# EAGLE design main (EAGLE 5.11)
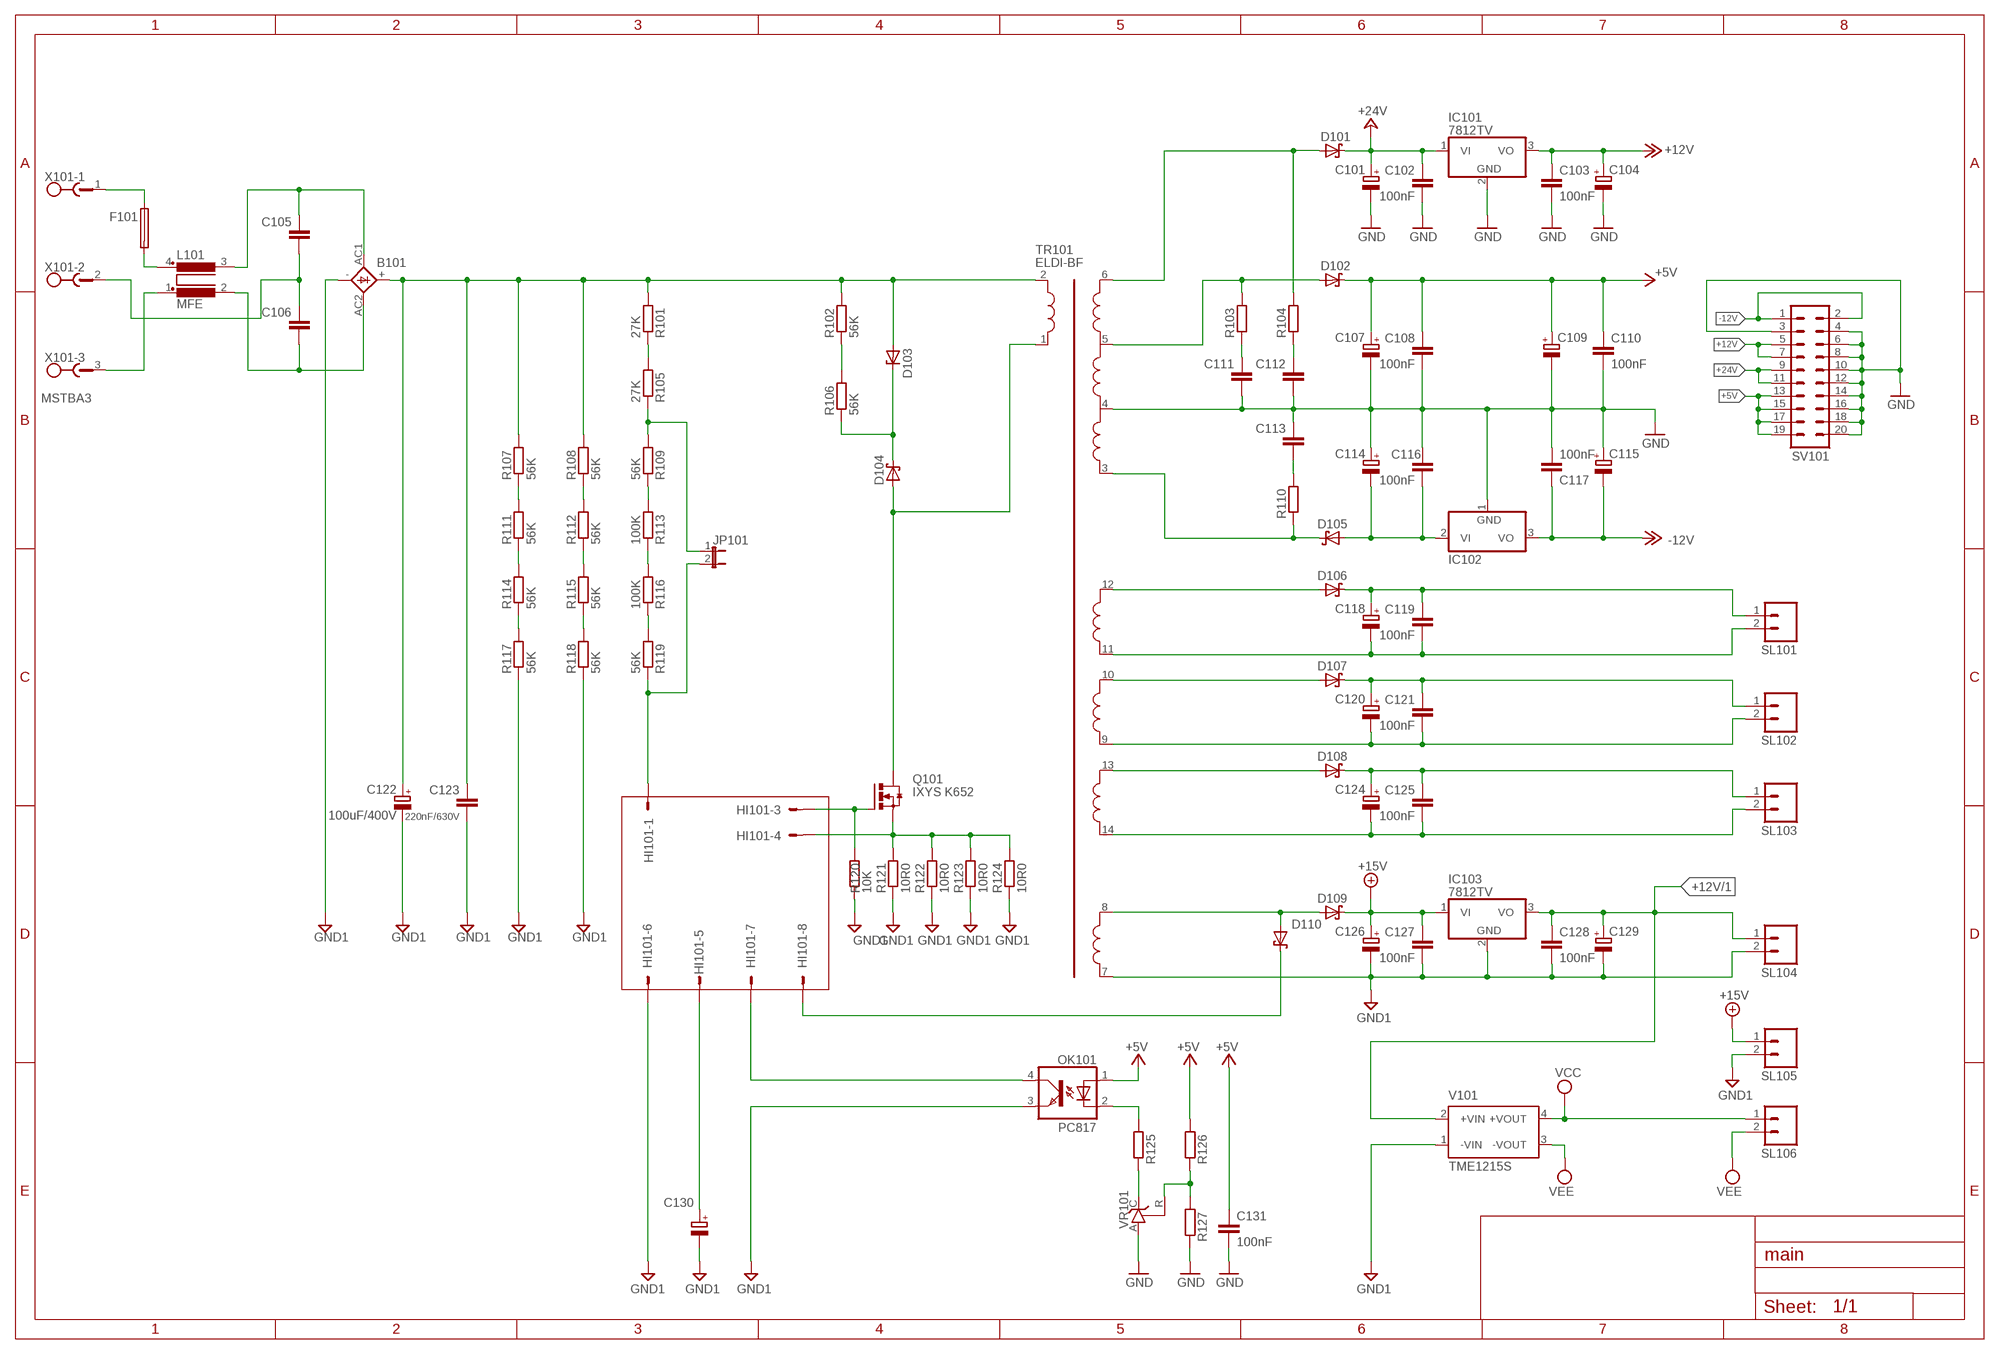
[diagram p0: schematic, sheet 1]

## Parts
B101  KBU  [KBU]
C101  CPOL-EUE3.5-10  [E3,5-10]
C102  100nF  C-EUC1206  [C1206]
C103  100nF  C-EUC1206  [C1206]
C104  CPOL-EUE3.5-10  [E3,5-10]
C105  C-EU102-054X133  [C102-054X133]
C106  C-EU102-054X133  [C102-054X133]
C107  CPOL-EUE3.5-10  [E3,5-10]
C108  100nF  C-EUC1206  [C1206]
C109  CPOL-EUE3.5-10  [E3,5-10]
C110  100nF  C-EUC1206  [C1206]
C111  C-EUC1206  [C1206]
C112  C-EUC1206  [C1206]
C113  C-EUC1206  [C1206]
C114  CPOL-EUE3.5-10  [E3,5-10]
C115  CPOL-EUE3.5-10  [E3,5-10]
C116  100nF  C-EUC1206  [C1206]
C117  100nF  C-EUC1206  [C1206]
C118  CPOL-EUE3.5-8  [E3,5-8]
C119  100nF  C-EUC1206  [C1206]
C120  CPOL-EUE3.5-8  [E3,5-8]
C121  100nF  C-EUC1206  [C1206]
C122  100uF/400V  CPOL-EUE10-25  [EB25D]
C123  220nF/630V  C-EU225-062X268  [C225-062X268]
C124  CPOL-EUE3.5-8  [E3,5-8]
C125  100nF  C-EUC1206  [C1206]
C126  CPOL-EUE3.5-8  [E3,5-8]
C127  100nF  C-EUC1206  [C1206]
C128  100nF  C-EUC1206  [C1206]
C129  CPOL-EUE3.5-8  [E3,5-8]
C130  CPOL-EUE3.5-8  [E3,5-8]
C131  100nF  C-EUC1206  [C1206]
D101  SCHOTTKY-DIODESMD  [SMB]
D102  SCHOTTKY-DIODESMD  [SMB]
D103  ZENER-DIODESMB  [SMB]
D104  SCHOTTKY-DIODESMD  [SMB]
D105  SCHOTTKY-DIODESMD  [SMB]
D106  SCHOTTKY-DIODESMD  [SMB]
D107  SCHOTTKY-DIODESMD  [SMB]
D108  SCHOTTKY-DIODESMD  [SMB]
D109  SCHOTTKY-DIODESMD  [SMB]
D110  SCHOTTKY-DIODESMD  [SMB]
F101  GSH15  [GSH15]
HI101  M08S  [08P]
IC101  7812TV  [TO220V]
IC102  7912T  [TO220H]
IC103  7812TV  7805TV  [TO220V]
JP101  JP1E  [JP1]
L101  MFE  [MFE]
OK101  PC817  [DIL04]
Q101  IXYS K652  IRF3704S  [D2PACK]
R101  27K  R-EU_R1206  [R1206]
R102  56K  R-EU_R1206  [R1206]
R103  R-EU_R1206  [R1206]
R104  R-EU_R1206  [R1206]
R105  27K  R-EU_R1206  [R1206]
R106  56K  R-EU_R1206  [R1206]
R107  56K  R-EU_R1206  [R1206]
R108  56K  R-EU_R1206  [R1206]
R109  56K  R-EU_R1206  [R1206]
R110  R-EU_R1206  [R1206]
R111  56K  R-EU_R1206  [R1206]
R112  56K  R-EU_R1206  [R1206]
R113  100K  R-EU_R1206  [R1206]
R114  56K  R-EU_R1206  [R1206]
R115  56K  R-EU_R1206  [R1206]
R116  100K  R-EU_R1206  [R1206]
R117  56K  R-EU_R1206  [R1206]
R118  56K  R-EU_R1206  [R1206]
R119  56K  R-EU_R1206  [R1206]
R120  10K  R-EU_R1206  [R1206]
R121  10R0  R-EU_R1206  [R1206]
R122  10R0  R-EU_R1206  [R1206]
R123  10R0  R-EU_R1206  [R1206]
R124  10R0  R-EU_R1206  [R1206]
R125  R-EU_R1206  [R1206]
R126  R-EU_R1206  [R1206]
R127  R-EU_R1206  [R1206]
SL101  M02  [02P]
SL102  M02  [02P]
SL103  M02  [02P]
SL104  M02  [02P]
SL105  M02  [02P]
SL106  M02  [02P]
SV101  ML20  [ML20]
TR101  ELDI-BF  TRAF-ELDY-BF  [TRAF-ELDI-BF]
V101  TME1215S  [TME]
VR101  TL431CLP  [TO92-CLP]
X101  MSTBA3  [MSTBA3]

## Nets
+5V: C107.+ C108.1 C109.+ C110.1 C131.1 D102.C OK101.1(A) R126.2 SV101.13 SV101.15 SV101.17 SV101.19
+12V: C103.1 C104.+ IC101.3(VO) SV101.5 SV101.7
+12V/1: C128.1 C129.+ IC103.3(VO) SL104.1 V101.2(+VIN)
+15V: C126.+ C127.1 D109.C IC103.1(VI) SL105.1
+24V: C101.+ C102.1 D101.C IC101.1(VI) SV101.9 SV101.11
-12V: C115.- C117.1 IC102.3(VO) SV101.1 SV101.2
GND: C101.- C102.2 C103.2 C104.- C107.- C108.2 C109.- C110.2 C111.2 C112.2 C113.1 C114.+ C115.+ C116.2 C117.2 C131.2 IC101.2(GND) IC102.1(GND) R127.1 SV101.3 SV101.4 SV101.6 SV101.8 SV101.10 SV101.12 SV101.14 SV101.16 SV101.18 SV101.20 TR101.4 VR101.A
GND1: B101.- C122.- C123.2 C126.- C127.2 C128.2 C129.- C130.- HI101.6 IC103.2(GND) OK101.3(EMIT) R117.1 R118.1 R120.1 R121.1 R122.1 R123.1 R124.1 SL104.2 SL105.2 TR101.7 V101.1(-VIN)
N$1: F101.1 X101.1
N$2: F101.2 L101.4
N$3: L101.1 X101.3
N$4: B101.+ C122.+ C123.1 D103.A R101.2 R102.2 R107.2 R108.2 TR101.2
N$9: C114.- C116.1 D105.A IC102.2(VI)
N$10: D105.C R110.1 TR101.3
N$11: D101.A R104.2 TR101.6
N$12: R114.1 R117.2
N$13: D102.A R103.2 TR101.5
N$14: B101.AC2 C106.2 L101.2
N$15: B101.AC1 C105.1 L101.3
N$16: C113.2 R110.2
N$17: C111.1 R103.1
N$18: C112.1 R104.1
N$19: HI101.4 Q101.3(S) R121.2 R122.2 R123.2 R124.2
N$20: HI101.3 Q101.1(G) R120.2
N$21: D104.A Q101.2(D) TR101.1
N$22: D103.C D104.C R106.1
N$23: C105.2 C106.1 X101.2
N$24: R102.1 R106.2
N$25: D109.A D110.A TR101.8
N$26: D108.A TR101.13
N$27: D106.A TR101.12
N$28: R111.1 R114.2
N$30: D110.C HI101.8
N$32: D107.A TR101.10
N$33: R125.1 VR101.C
N$34: OK101.2(C) R125.2
N$35: R126.1 R127.2 VR101.R
N$36: JP101.1 R105.1 R109.2
N$37: HI101.7 OK101.4(COL)
N$38: R107.1 R111.2
N$39: R113.1 R116.2
N$40: R116.1 R119.2
N$41: R109.1 R113.2
N$42: HI101.1 JP101.2 R119.1
N$43: R101.1 R105.2
N$61: R108.1 R112.2
N$62: R112.1 R115.2
N$63: R115.1 R118.2
N$64: C130.+ HI101.5
U+: C118.+ C119.1 D106.C SL101.1
U_GND: C118.- C119.2 SL101.2 TR101.11
V+: C120.+ C121.1 D107.C SL102.1
V_GND: C120.- C121.2 SL102.2 TR101.9
VCC: SL106.1 V101.4(+VOUT)
VEE: SL106.2 V101.3(-VOUT)
W+: C124.+ C125.1 D108.C SL103.1
W_GND: C124.- C125.2 SL103.2 TR101.14
Unconnected: HI101.2

## Library data of the parts
B101 = rectifier:KBU: DIOTEC RECTIFIER
C101 C104 C107 C109 C114 C115 C118 C120 C122 C124 C126 C129 C130 = rcl:CPOL-EU: POLARIZED CAPACITOR, European symbol
C102 C103 C105 C106 C108 C110-C113 C116 C117 C119 C121 C123 C125 C127 C128 C131 = rcl:C-EU: CAPACITOR, European symbol
D101 D102 D104-D110 = diode:SCHOTTKY-DIODE: Schottky Diode
D103 = diode:ZENER-DIODE: Z-Diode
F101 = fuse:GSH15: FUSE HOLDER grid 15mm, 19649 Wickmann; MPN: 64900001039; OC_FARNELL: 1271673; OC_NEWARK: 02P0318
HI101 = con-amp-quick:M08S: AMP QUICK CONNECTOR; OC_FARNELL: unknown; OC_NEWARK: unknown
IC101 IC103 = linear:78*: Positive VOLTAGE REGULATOR Source: http://cache.national.com/ds/LM/LM78L05.pdf http://www.fairchildsemi.com/ds/LM/LM7805.pdf
IC102 = linear:79*: Negative VOLTAGE REGULATOR
JP101 = jumper:JP1E: JUMPER
L101 = inductors:MFE: FILTER
OK101 = optocoupler:PC817: SHARP OPTO COUPLER; MPN: PC817X4J000F; OC_FARNELL: 9707727; OC_NEWARK: 97K7059
Q101 = transistor-power:IRF3704: SMPS MOSFET HEXFET® Power MOSFET Source: http://www.irf.com/product-info/datasheets/data/irf3704.pdf
R101-R127 = rcl:R-EU_: RESISTOR, European symbol
SL101-SL106 = con-amp-quick:M02: AMP QUICK CONNECTOR; OC_FARNELL: unknown; OC_NEWARK: unknown
SV101 = con-harting-ml:ML20: HARTING; OC_FARNELL: unknown; OC_NEWARK: unknown
TR101 = electroinvent:TRAF-ELDY-BF
V101 = traco-electronic:TME?*: DC/DC Converter TME Series 1 Watt Source: www.tracopower.com .. tme.pdf; MPN: TME 1215S; OC_FARNELL: 1007546; OC_NEWARK: 51R5328
VR101 = v-reg:TL431CLP: VOLTAGE REGULATOR
X101 = con-phoenix-508:MSTBA3: PHOENIX; MF: FARNELL; MPN: 1757255; OC_FARNELL: 3705183; OC_NEWARK: 71C4162

## Board
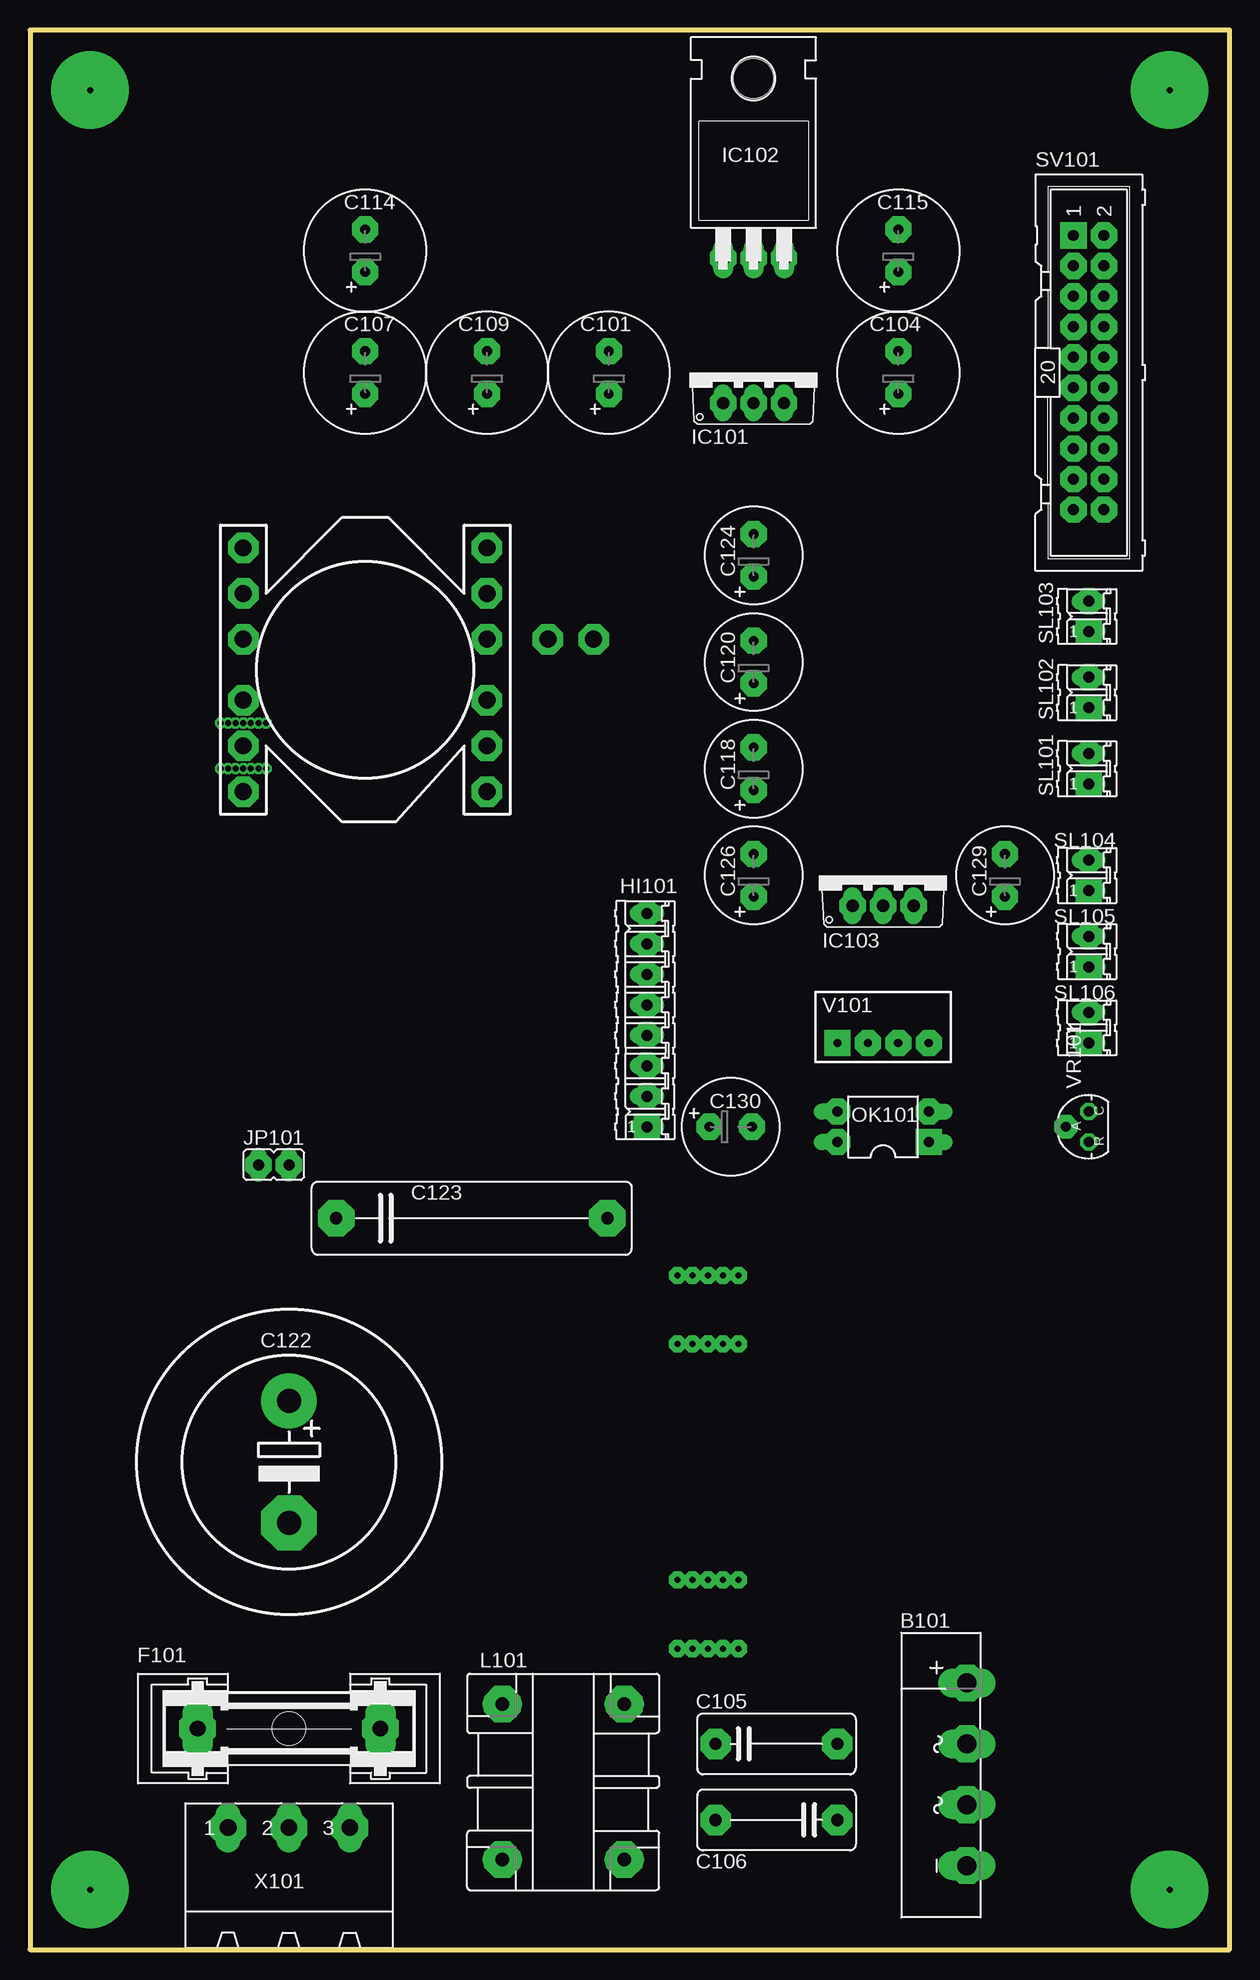
[diagram p1: board, top side]
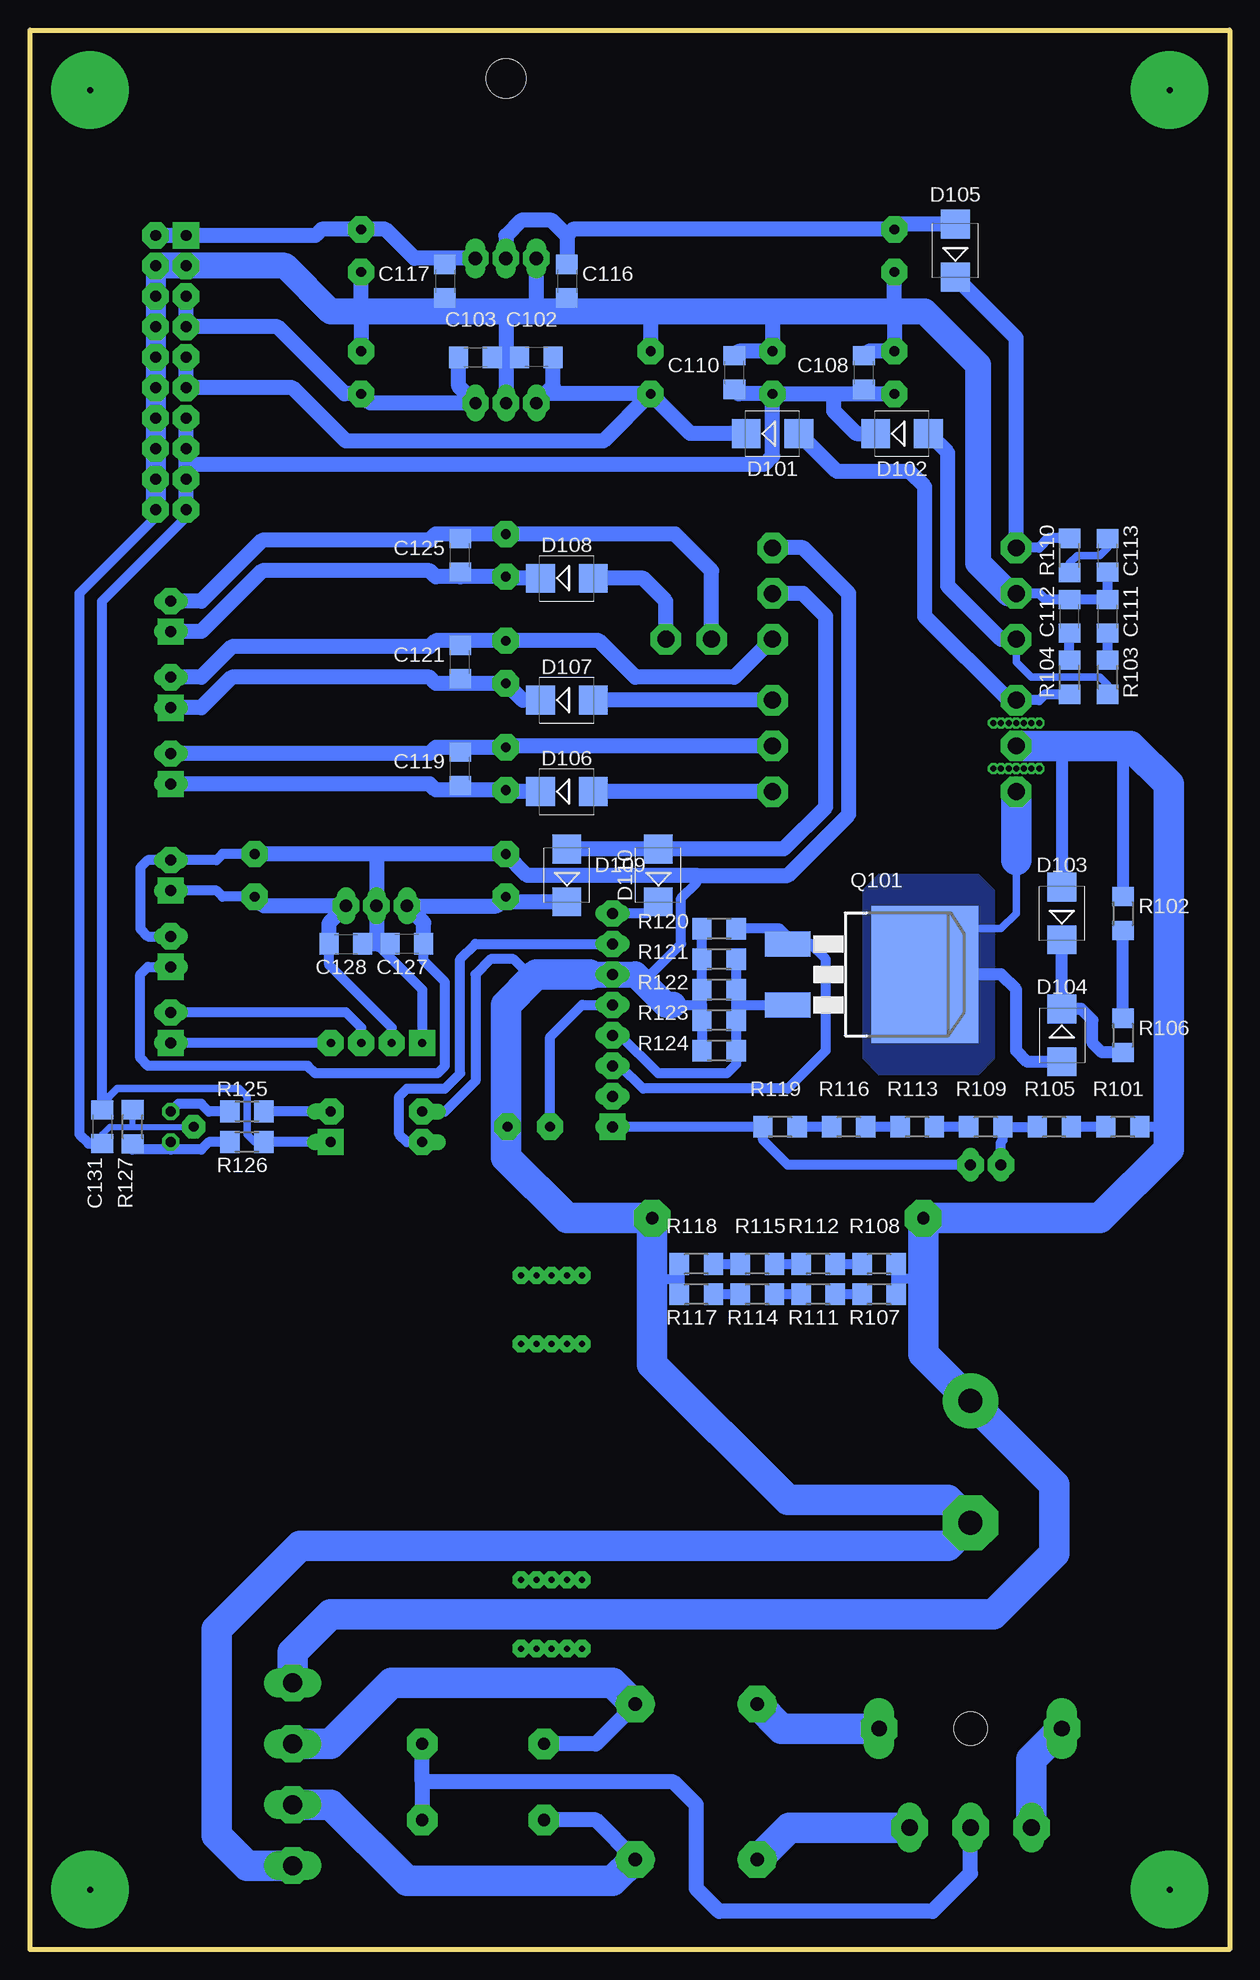
[diagram p2: board, bottom side, seen from below]

Size 100 x 160 mm. Coordinates in mm from the lower left corner, seen from the top.
Outline: 0,0 100,0 100,160 0,160 0,0
Copper layers (1*16): Top 0.035mm / dielectric 1.5mm / Bottom 0.035mm
Design rules "default": minimum track width 10mil, minimum drill 24mil, track to track 8mil, track to pad 8mil, pad to pad 8mil, via to via 8mil, smd to smd 8mil, copper to edge 40mil, drill to drill 8mil, minimum pad ring 10mil, minimum via ring 8mil, stop-mask expansion 4mil, vias tented up to drill 0mil, thermal gap 10mil

### Footprints (pad centres in the part's own frame; a part is rotated, then mirrored left to right if it is on the bottom)
KBU = drill 1.6 long: + -7.62,2.54; - 7.62,2.54; AC1 -2.54,2.54; AC2 2.54,2.54
E3,5-10 = drill 0.813 pad 1.6 round: + -1.778,0 | drill 0.813 pad 1.6 octagon: - 1.778,0
C1206 = smd 1.6 x 1.8: 1 -1.4,0; 2 1.4,0
C102-054X133 = drill 1.016 octagon: 1 -5.08,0; 2 5.08,0
E3,5-8 = drill 0.813 pad 1.6 round: + -1.778,0 | drill 0.813 pad 1.6 octagon: - 1.778,0
EB25D = drill 2.007 pad 4.597 round: + -5.08,0 | drill 2.007 pad 4.597 octagon: - 5.08,0
C225-062X268 = drill 1.016 octagon: 1 -11.303,0; 2 11.303,0
SMB = smd 2.4 x 2.4: A 2.2,0; C -2.2,0
GSH15 = drill 1.321 pad 2.54 long: 1 -7.62,0; 2 7.62,0 | hole 2.794: 0,0
08P = drill 0.914 long: 1 -8.89,0; 2 -6.35,0; 3 -3.81,0; 4 -1.27,0; 5 1.27,0; 6 3.81,0; 7 6.35,0; 8 8.89,0
TO220V = drill 1.016 long: 1 -2.54,-2.54; 2 0,-2.54; 3 2.54,-2.54
TO220H = drill 1.118 long: 1 -2.54,-10.16; 2 0,-10.16; 3 2.54,-10.16 | hole 3.302: 0,4.826
JP1 = drill 0.914 long: 1 0,-1.27; 2 0,1.27
MFE = drill 1.118 long: 1 6.477,-5.08; 2 6.477,5.08; 3 -6.477,5.08; 4 -6.477,-5.08
DIL04 = drill 0.813 offset: 1 -1.27,-3.81; 2 1.27,-3.81; 3 1.27,3.81; 4 -1.27,3.81
D2PACK = smd 2.083 x 3.81: 1 -2.54,-8.89; 3 2.54,-8.89 | smd 11.43 x 8.89: 2 0,2.54
R1206 = smd 1.6 x 1.803: 1 -1.422,0; 2 1.422,0
02P = drill 0.914 long: 1 -1.27,0; 2 1.27,0
ML20 = drill 0.914 octagon: 1 -11.43,-1.27; 2 -11.43,1.27; 3 -8.89,-1.27; 4 -8.89,1.27; 5 -6.35,-1.27; 6 -6.35,1.27; 7 -3.81,-1.27; 8 -3.81,1.27; 9 -1.27,-1.27; 10 -1.27,1.27; 11 1.27,-1.27; 12 1.27,1.27; 13 3.81,-1.27; 14 3.81,1.27; 15 6.35,-1.27; 16 6.35,1.27; 17 8.89,-1.27; 18 8.89,1.27; 19 11.43,-1.27; 20 11.43,1.27
TRAF-ELDI-BF = drill 1.4 octagon: 1 -10.16,10.16; 2 -6.35,10.16; 3 10.16,10.16; 4 6.35,10.16; 5 2.54,10.16; 6 -2.54,10.16; 7 10.16,-10.16; 8 6.35,-10.16; 9 2.54,-10.16; 10 -2.54,-10.16; 11 -6.35,-10.16; 12 -10.16,-10.16; 13 2.54,-19.05; 14 2.54,-15.24
TME = drill 0.7 pad 1.1 round: 1 -3.81,0; 2 -1.27,0; 3 1.27,0; 4 3.81,0
TO92-CLP = drill 0.813 octagon: A 0,1.905; C 1.27,0; R -1.27,0
MSTBA3 = drill 1.397 long: 1 -5.08,5.08; 2 0,5.08; 3 5.08,5.08

### Placement (x,y rotation side)
B101  75.56,14.61 270 top
C101  48.26,131.44 90 top
C102  57.78,132.72 180 bottom
C103  62.87,132.72 0 bottom
C104  72.39,131.44 90 top
C105  62.23,17.14 0 top
C106  62.23,10.79 180 top
C107  27.94,131.44 90 top
C108  30.48,131.44 90 bottom
C109  38.1,131.44 90 top
C110  41.27,131.44 90 bottom
C111  10.16,111.12 90 bottom
C112  13.34,111.12 90 bottom
C113  10.16,116.2 90 bottom
C114  27.94,141.6 90 top
C115  72.39,141.6 90 top
C116  55.24,139.06 270 bottom
C117  65.41,139.06 270 bottom
C118  60.33,98.42 90 top
C119  64.14,98.42 90 bottom
C120  60.33,107.31 90 top
C121  64.14,107.31 90 bottom
C122  21.59,40.64 270 top
C123  36.83,60.96 0 top
C124  60.33,116.2 90 top
C125  64.14,116.2 90 bottom
C126  60.33,89.53 90 top
C127  68.58,83.82 180 bottom
C128  73.66,83.82 0 bottom
C129  81.28,89.53 90 top
C130  58.42,68.58 0 top
C131  93.98,68.58 270 bottom
D101  38.1,126.36 0 bottom
D102  27.3,126.36 0 bottom
D103  13.97,86.36 90 bottom
D104  13.97,76.2 270 bottom
D105  22.86,141.6 90 bottom
D106  55.24,96.52 0 bottom
D107  55.24,104.14 0 bottom
D108  55.24,114.3 0 bottom
D109  55.24,89.53 90 bottom
D110  47.62,89.53 90 bottom
F101  21.59,18.41 0 top
HI101  51.44,77.47 90 top
IC101  60.33,131.44 0 top
IC102  60.33,151.13 0 top
IC103  71.12,89.53 0 top
JP101  20.32,65.41 270 top
L101  44.45,13.97 270 top
OK101  71.12,68.58 90 top
Q101  27.94,81.28 270 bottom
R101  8.89,68.58 0 bottom
R102  8.89,86.36 90 bottom
R103  10.16,106.05 270 bottom
R104  13.34,106.05 270 bottom
R105  14.61,68.58 0 bottom
R106  8.89,76.2 90 bottom
R107  29.21,54.61 0 bottom
R108  29.21,57.15 0 bottom
R109  20.32,68.58 0 bottom
R110  13.34,116.2 270 bottom
R111  34.29,54.61 0 bottom
R112  34.29,57.15 0 bottom
R113  26.04,68.58 0 bottom
R114  39.37,54.61 0 bottom
R115  39.37,57.15 0 bottom
R116  31.75,68.58 0 bottom
R117  44.45,54.61 0 bottom
R118  44.45,57.15 0 bottom
R119  37.47,68.58 0 bottom
R120  42.55,85.09 0 bottom
R121  42.55,82.55 0 bottom
R122  42.55,80.01 0 bottom
R123  42.55,77.47 0 bottom
R124  42.55,74.93 0 bottom
R125  81.92,69.85 0 bottom
R126  81.92,67.31 0 bottom
R127  91.44,68.58 270 bottom
SL101  88.27,98.42 90 top
SL102  88.27,104.78 90 top
SL103  88.27,111.12 90 top
SL104  88.27,89.53 90 top
SL105  88.27,83.19 90 top
SL106  88.27,76.83 90 top
SV101  88.27,131.44 270 top
TR101  27.94,106.68 90 top
V101  71.12,75.56 0 top
VR101  88.27,68.58 90 top
X101  21.59,5.08 0 top

### Tracks (layer width: path | path; a pad name or v marks a point on that pad's centre or on a via)
+5V  (via drill 0.5 pad 2.18)
  Bottom 0.61: R126.2 81.28,67.31 81.92,67.94 81.92,71.12 82.55,71.75 92.71,71.75 93.98,70.48
  Bottom 0.813: v87,120.02 87,119.38 93.98,112.39 93.98,70.48 C131.1 | OK101.1 R126.2
  Bottom 1.27: 30.48,129.67 C107.+ | C109.+ 33.02,129.67 | 33.02,129.67 30.48,129.67 | C109.+ 40.9,129.67 C110.1 | 30.48,129.67 C108.1 | C109.+ 38.1,124.46 38.73,123.83 87,123.83 | v87,120.02 v87,122.56 87,123.83 | 87,123.83 SV101.15 v87,127.64 | D102.C 31.11,126.36 33.02,128.27 33.02,129.67
  other vias: 74.93,67.31 87,125.09 27.94,129.67 38.1,129.67
+12V  (via drill 0.5 pad 2.18)
  Bottom 1.27: C103.1 64.27,130.31 IC101.3 71.63,128.91 C104.+ 73.79,129.67 79.38,135.25 SV101.7 SV101.5
  other vias: 62.87,128.91 87,137.79 87,135.25 72.39,129.67
+12V/1  (via drill 0.5 pad 2.18)
  Bottom 0.813: C129.+ 83.95,87.76 84.45,88.27 SL104.1 | V101.2 69.85,76.83 75.06,82.05 C128.1
  Bottom 1.27: C129.+ 80.52,87 v73.66,87 75.06,85.59 C128.1
  other vias: 88.27,88.27 81.28,87.76 69.85,75.56
+15V  (via drill 0.5 pad 2.18)
  Bottom 0.813: C127.1 67.18,82.42 65.41,80.64 65.41,73.66 66.04,73.03 76.2,73.03 76.83,73.66 90.17,73.66 90.81,74.3 90.81,81.28 90.17,81.92 SL105.1
  Bottom 1.27: D109.C 59.9,87.33 C126.+ 61.09,87 v68.58,87 67.18,85.59 C127.1
  other vias: 88.27,81.92 60.33,87.76
+24V  (via drill 0.5 pad 2.18)
  Bottom 1.27: D101.C 44.96,126.36 C101.+ | C101.+ 57.02,129.67 v57.78,128.91 56.38,130.31 C102.1 | C101.+ 52.2,125.73 73.66,125.73 78.11,130.18 v87,130.18 SV101.9
  other vias: 87,132.72 48.26,129.67
-12V  (via drill 0.5 pad 2.18)
  Bottom 1.27: IC102.3 65.41,140.97 | 65.41,140.97 67.94,140.97 70.36,143.38 C115.- 75.69,143.38 76.2,142.88 SV101.1 SV101.2 | 65.41,140.97 C117.1
  other vias: 62.87,140.97 87,142.88 72.39,143.38 89.53,142.88
GND  (via drill 0.5 pad 1.93, 0.5 pad 2.18, 0.5 pad 2.54)
  Bottom 0.508: 91.44,68.58 93.34,68.58 93.98,67.94 C131.2 | 91.44,68.58 VR101.A | 91.44,68.58 R127.1
  Bottom 0.813: C113.1 C111.2 C112.2 15.37,112.53 15.88,113.03 TR101.4 | v89.53,120.02 89.53,119.38 95.89,113.03 95.89,67.94 95.12,67.18 C131.2
  Bottom 1.27: C108.2 30.1,133.22 C107.- 27.94,136.53 C114.+ | C110.2 40.9,133.22 C109.- 38.1,136.53 | 48.26,136.53 C101.- | 60.33,136.53 60.33,132.72 | 60.33,132.72 IC101.2 | 60.33,132.72 C102.2 | 60.33,132.72 C103.2 | C104.- 72.39,136.53 C115.+ | 57.78,136.53 v57.78,140.97 | 55.24,136.53 C116.2 | 65.41,136.53 C117.2
  Bottom 1.676: v89.53,140.34 SV101.6 SV101.8 SV101.10 v89.53,130.18 v89.53,127.64 SV101.16 v89.53,122.56 v89.53,120.02
  Bottom 2.184: TR101.4 18.41,113.03 20.95,115.57 20.95,132.08 25.4,136.53 27.94,136.53 38.1,136.53 48.26,136.53 55.24,136.53 57.78,136.53 60.33,136.53 65.41,136.53 72.39,136.53 74.93,136.53 78.74,140.34 v87,140.34 v89.53,140.34
  other vias: 86.36,68.58 60.33,128.91 89.53,125.09 89.53,132.72 89.53,135.25 89.53,137.79 27.94,133.22 38.1,133.22 48.26,133.22 72.39,139.83 72.39,133.22 27.94,139.83 17.78,113.03
GND1  (via drill 0.5 pad 2.18, 0.5 pad 2.54, 0.5 pad 3.05)
  Bottom 0.813: R124.1 R123.1 43.97,78.74 | R120.1 R121.1 R122.1 43.97,78.74 | 46.35,78.74 43.97,78.74 | R117.1 R118.1 45.87,56.36 46.35,55.88 48.13,55.88 | HI101.6 48.26,81.28 45.72,83.82 45.72,87.63 44.45,88.9 44.45,89.53 | 71.12,83.82 67.31,80.01 V101.1 | OK101.3 65.41,69.85 62.87,72.39 62.87,81.28 61.59,82.55 59.69,82.55 58.1,80.96 | C129.- 83.95,91.31 84.45,90.81 v88.27,90.81 90.17,90.81 90.81,90.17 90.81,85.09 90.17,84.45 SL105.2 | C130.- 60.2,66.67 60.33,66.55
  Bottom 1.27: TR101.7 35.56,116.84 31.75,113.03 31.75,94.61 36.83,89.53 44.45,89.53 58.55,89.53 C126.- 71.12,91.31 | 71.12,91.31 C129.- | 71.12,91.31 v71.12,87 71.12,83.82 | 71.12,83.82 C127.2 | 71.12,83.82 C128.2
  Bottom 2.184: 53.34,81.28 HI101.6 49.53,81.28 46.99,78.74 46.35,78.74
  Bottom 2.54: 53.34,81.28 57.78,81.28 58.1,80.96 60.33,78.74 60.33,66.55 60.33,66.04 55.24,60.96 C123.2 48.13,55.88 48.13,48.77 36.83,37.47 23.5,37.47 C122.- 23.5,33.66 77.47,33.66 84.45,26.67 84.45,9.53 81.92,6.99 B101.-
  other vias: 67.31,69.85 51.44,81.28 78.11,6.99 21.59,35.56 67.31,75.56 88.27,84.45 60.33,91.31 81.28,91.31 60.2,68.58 48.13,60.96 38.1,116.84
N$1  (via drill 0.5 pad 3.05)
  Bottom 2.54: X101.1 16.51,15.88 F101.1
  other vias: 13.97,18.41 16.51,10.16
N$2  (via drill 0.5 pad 3.05)
  Bottom 2.54: F101.2 37.34,18.41 L101.4
  other vias: 39.37,20.45 29.21,18.41
N$3  (via drill 0.5 pad 3.05)
  Bottom 2.54: X101.3 36.7,10.16 L101.1
  other vias: 39.37,7.49 26.67,10.16
N$4  (via drill 0.5 pad 2.54, 0.5 pad 3.05)
  Bottom 0.813: 5.08,68.58 R101.2 | R108.2 R107.2 27.79,55.4 27.3,55.88 25.53,55.88
  Bottom 1.016: 13.97,100.33 D103.A | 8.89,100.33 R102.2
  Bottom 2.54: TR101.2 13.97,100.33 8.89,100.33 8.26,100.33 5.08,97.16 5.08,68.58 5.08,66.67 10.79,60.96 C123.1 25.53,55.88 25.53,49.66 C122.+ 14.61,38.73 14.61,33.02 19.68,27.94 74.93,27.94 78.11,24.77 B101.+
  other vias: 78.11,22.23 21.59,45.72 25.53,60.96 17.78,100.33
N$5  (via drill 0.5 pad 6.45)
  other vias: 5,155
N$6  (via drill 0.5 pad 6.45)
  other vias: 95,155
N$7  (via drill 0.5 pad 6.45)
  other vias: 5,5
N$8  (via drill 0.5 pad 6.45)
  other vias: 95,5
N$9  (via drill 0.5 pad 2.18)
  Bottom 1.27: D105.A 27.52,143.81 C114.- 54.74,143.38 55.24,142.88 | 55.24,142.88 C116.1 | 55.24,142.88 56.52,144.15 59.05,144.15 60.33,142.88 IC102.2
  other vias: 60.33,140.97 27.94,143.38
N$10  (via drill 0.5 pad 2.54)
  Bottom 0.813: R110.1 15.09,117.63 15.88,116.84 TR101.3
  Bottom 1.27: TR101.3 17.78,134.32 D105.C
  other vias: 17.78,116.84
N$11  (via drill 0.5 pad 2.54)
  Bottom 0.813: R104.2 15.39,104.62 15.88,104.14 TR101.6
  Bottom 1.27: TR101.6 18.41,104.14 25.4,111.12 25.4,121.92 26.67,123.19 32.73,123.19 D101.A
  other vias: 17.78,104.14
N$12
  Bottom 0.813: R114.1 R117.2
N$13  (via drill 0.5 pad 2.54)
  Bottom 0.61: R103.2 10.16,105.41 10.79,106.05 16.51,106.05 17.78,107.31 TR101.5
  Bottom 1.27: TR101.5 19.05,109.22 23.5,113.67 23.5,124.75 D102.A
  other vias: 17.78,109.22
N$14  (via drill 0.5 pad 2.54, 0.5 pad 3.05)
  Bottom 1.27: C106.2 52.83,10.79 L101.2
  Bottom 2.54: L101.2 49.66,7.49 51.44,5.71 68.58,5.71 74.93,12.06 v78.11,12.06
  other vias: 49.53,7.49 57.15,10.79
N$15  (via drill 0.5 pad 2.54, 0.5 pad 3.05)
  Bottom 1.27: C105.1 52.83,17.14 L101.3
  Bottom 2.54: L101.3 49.66,20.45 51.44,22.23 69.85,22.23 74.93,17.14 B101.AC1
  other vias: 78.11,17.14 49.53,20.45 57.15,17.14
N$16
  Bottom 0.61: R110.2 13.34,115.57 12.7,116.2 10.79,116.2 10.16,116.84 C113.2
N$17
  Bottom 0.813: R103.1 C111.1
N$18
  Bottom 0.813: R104.1 C112.1
N$19  (via drill 0.5 pad 2.18)
  Bottom 0.813: 41.12,78.74 R123.2 R124.2 41.12,73.81 41.91,73.03 47.62,73.03 50.8,76.2 HI101.4 | 41.12,78.74 R122.2 R121.2 | 41.12,78.74 Q101.3
  other vias: 51.44,76.2
N$20  (via drill 0.5 pad 2.18)
  Bottom 0.813: HI101.3 50.8,73.66 48.9,71.75 36.83,71.75 33.66,74.93 33.66,82.55 34.92,83.82 Q101.1 36.83,84.45 37.47,85.09 R120.2
  other vias: 51.44,73.66
N$21  (via drill 0.5 pad 2.54)
  Bottom 0.61: 17.78,90.81 17.78,86.36 19.05,85.09 25.4,85.09 Q101.2
  Bottom 1.016: D104.A 16.85,74 17.78,74.93 17.78,80.01 19.05,81.28 Q101.2
  Bottom 2.54: 17.78,90.81 TR101.1
  other vias: 17.78,96.52
  pour Bottom (isolate 0.61, no thermals): 19.68,74.3 19.68,88.27 20.95,89.53 29.21,89.53 30.48,88.27 30.48,74.3 29.21,73.03 20.95,73.03
N$22
  Bottom 1.016: D103.C D104.C 12.36,78.4 11.43,77.47 11.43,75.56 10.64,74.78 R106.1
N$23  (via drill 0.5 pad 2.54, 0.5 pad 3.05)
  Bottom 1.27: 67.31,13.97 C106.1 | 67.31,13.97 C105.2 | 67.31,13.97 46.35,13.97 44.45,12.06 44.45,5.08 42.55,3.17 24.77,3.17 21.59,6.35 X101.2
  other vias: 67.31,17.14 67.31,10.79 21.59,10.16
N$24
  Bottom 1.016: R106.2 R102.1
N$25  (via drill 0.5 pad 2.54)
  Bottom 1.27: TR101.8 35.56,113.03 33.66,111.12 33.66,95.25 37.17,91.73 D110.A D109.A
  other vias: 38.1,113.03
N$26  (via drill 0.5 pad 2.54)
  Bottom 1.27: TR101.13 46.99,112.39 48.9,114.3 D108.A
  other vias: 46.99,109.22
N$27  (via drill 0.5 pad 2.54)
  Bottom 1.27: TR101.12 D106.A
  other vias: 38.1,96.52
N$28
  Bottom 0.813: R111.1 R114.2
N$29  (via drill 0.5 pad 2.18)
  other vias: 60.33,96.65
N$30  (via drill 0.5 pad 2.18)
  Bottom 0.813: HI101.8 48.6,86.36 D110.C
  other vias: 51.44,86.36
N$31  (via drill 0.5 pad 1.42)
  other vias: 56.52,25.08
N$32  (via drill 0.5 pad 2.54)
  Bottom 1.27: TR101.10 D107.A
  other vias: 38.1,104.14
N$33  (via drill 0.5 pad 1.42)
  Bottom 0.813: R125.1 85.09,69.85 85.72,70.48 87.63,70.48 VR101.C
  other vias: 88.27,69.85
N$34  (via drill 0.5 pad 2.18)
  Bottom 0.813: OK101.2 R125.2
  other vias: 74.93,69.85
N$35  (via drill 0.5 pad 1.42)
  Bottom 0.813: R126.1 85.09,67.31 85.72,66.67 88.27,66.67 | 88.27,66.67 VR101.R | R127.2 91.44,66.67 88.27,66.67
  other vias: 88.27,67.31
N$36  (via drill 0.5 pad 2.18)
  Bottom 0.813: R105.1 R109.2 18.9,67.46 19.05,67.31 JP101.1
  other vias: 19.05,65.41
N$37  (via drill 0.5 pad 2.18)
  Bottom 0.813: HI101.7 62.87,83.82 64.14,82.55 64.14,73.03 65.41,71.75 68.58,71.75 69.22,71.12 69.22,67.94 68.58,67.31 OK101.4
  other vias: 67.31,67.31 51.44,83.82
N$38
  Bottom 0.813: R107.1 R111.2
N$39
  Bottom 0.813: R113.1 R116.2
N$40
  Bottom 0.813: R116.1 R119.2
N$41
  Bottom 0.813: R109.1 R113.2
N$42  (via drill 0.5 pad 2.18)
  Bottom 0.813: HI101.1 R119.1 38.89,67.46 36.83,65.41 JP101.2
  other vias: 51.44,68.58 21.59,65.41
N$43
  Bottom 0.813: R101.1 R105.2
N$44  (via drill 0.5 pad 1.42)
  other vias: 56.52,56.2
N$45  (via drill 0.5 pad 0.81)
  other vias: 17.78,98.42
N$46  (via drill 0.5 pad 2.18)
  other vias: 51.44,71.12
N$47  (via drill 0.5 pad 2.18)
  other vias: 51.44,78.74
N$48  (via drill 0.5 pad 0.81)
  other vias: 17.14,98.42
N$49  (via drill 0.5 pad 0.81)
  other vias: 18.41,98.42
N$50  (via drill 0.5 pad 0.81)
  other vias: 19.05,98.42
N$51  (via drill 0.5 pad 0.81)
  other vias: 16.51,98.42
N$52  (via drill 0.5 pad 0.81)
  other vias: 15.88,98.42
N$53  (via drill 0.5 pad 0.81)
  other vias: 19.68,98.42
N$54  (via drill 0.5 pad 0.81)
  other vias: 15.88,102.23
N$55  (via drill 0.5 pad 0.81)
  other vias: 16.51,102.23
N$56  (via drill 0.5 pad 0.81)
  other vias: 17.14,102.23
N$57  (via drill 0.5 pad 0.81)
  other vias: 17.78,102.23
N$58  (via drill 0.5 pad 0.81)
  other vias: 18.41,102.23
N$59  (via drill 0.5 pad 0.81)
  other vias: 19.05,102.23
N$60  (via drill 0.5 pad 0.81)
  other vias: 19.68,102.23
N$61
  Bottom 0.813: R112.2 R108.1
N$62
  Bottom 0.813: R115.2 R112.1
N$63
  Bottom 0.813: R118.2 R115.1
N$64  (via drill 0.5 pad 2.18)
  Bottom 0.813: C130.+ 56.64,76.07 53.98,78.74 HI101.5
  other vias: 56.64,68.58
N$65  (via drill 0.5 pad 1.42)
  other vias: 57.78,56.2
N$66  (via drill 0.5 pad 1.42)
  other vias: 55.24,56.2
N$67  (via drill 0.5 pad 1.42)
  other vias: 59.05,56.2
N$68  (via drill 0.5 pad 1.42)
  other vias: 53.98,56.2
N$69  (via drill 0.5 pad 1.42)
  other vias: 57.78,25.08
N$70  (via drill 0.5 pad 1.42)
  other vias: 55.24,25.08
N$71  (via drill 0.5 pad 1.42)
  other vias: 53.98,25.08
N$72  (via drill 0.5 pad 1.42)
  other vias: 59.05,25.08
N$73  (via drill 0.5 pad 1.42)
  other vias: 53.98,30.8
N$74  (via drill 0.5 pad 1.42)
  other vias: 55.24,30.8
N$75  (via drill 0.5 pad 1.42)
  other vias: 56.52,30.8
N$76  (via drill 0.5 pad 1.42)
  other vias: 57.78,30.8
N$77  (via drill 0.5 pad 1.42)
  other vias: 59.05,30.8
N$78  (via drill 0.5 pad 1.42)
  other vias: 53.98,50.48
N$79  (via drill 0.5 pad 1.42)
  other vias: 55.24,50.48
N$80  (via drill 0.5 pad 1.42)
  other vias: 56.52,50.48
N$81  (via drill 0.5 pad 1.42)
  other vias: 57.78,50.48
N$82  (via drill 0.5 pad 1.42)
  other vias: 59.05,50.48
U+  (via drill 0.5 pad 2.18)
  Bottom 0.813: 64.14,96.65 C119.1
  Bottom 1.27: D106.C 60.2,96.52 C118.+ 64.14,96.65 66.17,96.65 66.67,97.16 SL101.1
  other vias: 88.27,97.16
U_GND  (via drill 0.5 pad 2.18, 0.5 pad 2.54)
  Bottom 0.813: 64.14,100.2 C119.2
  Bottom 1.27: TR101.11 60.2,100.33 C118.- 64.14,100.2 66.17,100.2 66.67,99.69 SL101.2
  other vias: 88.27,99.69 60.33,100.2 38.1,100.33
V+  (via drill 0.5 pad 2.18)
  Bottom 0.813: 64.14,105.54 C121.1
  Bottom 1.27: D107.C 58.93,104.14 C120.+ 64.14,105.54 66.17,105.54 66.67,106.05 83.19,106.05 85.72,103.5 v88.27,103.5
  other vias: 60.33,105.54
V_GND  (via drill 0.5 pad 2.18, 0.5 pad 2.54)
  Bottom 0.813: 64.14,109.09 C121.2
  Bottom 1.27: TR101.9 41.27,106.05 49.53,106.05 52.58,109.09 C120.- 64.14,109.09 66.17,109.09 66.67,108.58 83.19,108.58 85.72,106.05 SL102.2
  other vias: 88.27,106.05 60.33,109.09 38.1,109.22
VCC  (via drill 0.5 pad 2.18)
  Bottom 0.813: V101.4 SL106.1
  other vias: 74.93,75.56 88.27,75.56
VEE  (via drill 0.5 pad 2.18)
  Bottom 0.813: V101.3 72.39,76.83 73.66,78.11 v88.27,78.11
  other vias: 72.39,75.56
W+  (via drill 0.5 pad 2.18)
  Bottom 0.813: 64.14,114.43 C125.1
  Bottom 1.27: D108.C 60.2,114.3 C124.+ 64.14,114.43 66.17,114.43 66.67,114.94 80.64,114.94 85.72,109.86 SL103.1
  other vias: 88.27,109.86 60.33,114.43
W_GND  (via drill 0.5 pad 2.18, 0.5 pad 2.54)
  Bottom 0.813: 64.14,117.98 C125.2
  Bottom 1.27: TR101.14 43.18,114.94 46.23,117.98 C124.- 64.14,117.98 66.17,117.98 66.67,117.47 80.64,117.47 85.72,112.39 SL103.2
  other vias: 88.27,112.39 60.33,117.98 43.18,109.22